# Altium schematic sheet Connectors.SchDoc
size A3; DocumentNumber: 11; SheetNumber: 11; SheetTotal: 11
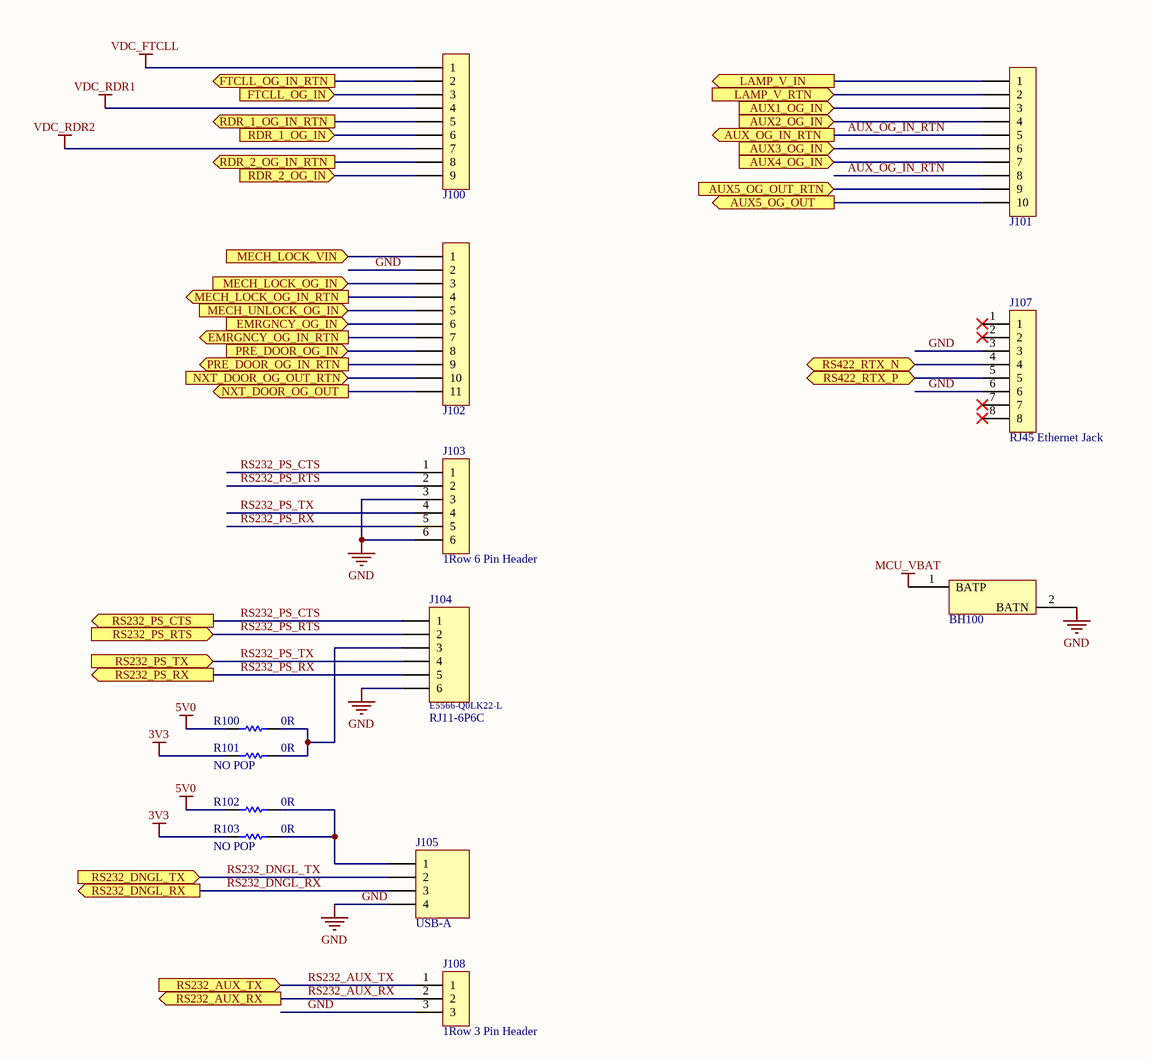
[diagram p0: Connectors.SchDoc]

## Parts
BH100  Battery Holder  [AE17-020T-2032-0101]  (value not drawn)
J100  (no value)  [AJ61-1009-TAPR-RNS0]
J101  (no value)  [AJ61-1010-TAPR-RNS0]
J102  (no value)  [AJ61-1011-TAPR-RNS0]
J103  1Row 6 Pin Header  [AJ23-1006-T8P0-VFC0]
J104  Manufacturer Part Number: E5566-Q0LK22-L  [AJ31-1006-TKSR-RPU0]  (hidden comment: RJ11-6P6C)
J105  USB-A  [AJA1-1004-TJSR-RAM0]
J107  RJ45 Ethernet Jack  [AJ32-1008-SD70-RTE0]
J108  1Row 3 Pin Header  [AJ23-1003-T8P0-VFC0]
R100  0R  [RESC1005X04N]
R101  Assembly: NO POP  [RESC1005X04N]  (hidden comment: 0R)
R102  0R  [RESC1005X04N]
R103  Assembly: NO POP  [RESC1005X04N]  (hidden comment: 0R)

## Ports
AUX1_OG_IN (in), AUX2_OG_IN (in), AUX3_OG_IN (in), AUX4_OG_IN (in), AUX5_OG_OUT (out), AUX5_OG_OUT_RTN (in), AUX_OG_IN_RTN (out), EMRGNCY_OG_IN (in), EMRGNCY_OG_IN_RTN (out), FTCLL_OG_IN (in), FTCLL_OG_IN_RTN (out), LAMP_V_IN (out), LAMP_V_RTN (in), MECH_LOCK_OG_IN (in), MECH_LOCK_OG_IN_RTN (out), MECH_LOCK_VIN (in), MECH_UNLOCK_OG_IN (in), NXT_DOOR_OG_OUT (out), NXT_DOOR_OG_OUT_RTN (in), PRE_DOOR_OG_IN (in), PRE_DOOR_OG_IN_RTN (out), RDR_1_OG_IN (in), RDR_1_OG_IN_RTN (out), RDR_2_OG_IN (in), RDR_2_OG_IN_RTN (out), RS232_AUX_RX (out), RS232_AUX_TX (in), RS232_DNGL_RX (out), RS232_DNGL_TX (in), RS232_PS_CTS (out), RS232_PS_RTS (in), RS232_PS_RX (out), RS232_PS_TX (in), RS422_RTX_N (bidir), RS422_RTX_P (bidir)

## Nets
3V3: R101.1 R103.1
5V0: R100.1 R102.1
GND: BH100.2(BATN) J102.2 J103.3 J103.6 J104.6 J105.4 J107.3 J107.6 J108.3
MCU_VBAT: BH100.1(BATP)
VDC_FTCLL: J100.1
VDC_RDR1: J100.4
VDC_RDR2: J100.7
AUX1_OG_IN: J101.3 ; port AUX1_OG_IN
AUX2_OG_IN: J101.4 ; port AUX2_OG_IN
AUX3_OG_IN: J101.6 ; port AUX3_OG_IN
AUX4_OG_IN: J101.7 ; port AUX4_OG_IN
AUX5_OG_OUT: J101.10 ; port AUX5_OG_OUT
AUX5_OG_OUT_RTN: J101.9 ; port AUX5_OG_OUT_RTN
AUX_OG_IN_RTN: J101.5 J101.8 ; port AUX_OG_IN_RTN
EMRGNCY_OG_IN: J102.6 ; port EMRGNCY_OG_IN
EMRGNCY_OG_IN_RTN: J102.7 ; port EMRGNCY_OG_IN_RTN
FTCLL_OG_IN: J100.3 ; port FTCLL_OG_IN
FTCLL_OG_IN_RTN: J100.2 ; port FTCLL_OG_IN_RTN
LAMP_V_IN: J101.1 ; port LAMP_V_IN
LAMP_V_RTN: J101.2 ; port LAMP_V_RTN
MECH_LOCK_OG_IN: J102.3 ; port MECH_LOCK_OG_IN
MECH_LOCK_OG_IN_RTN: J102.4 ; port MECH_LOCK_OG_IN_RTN
MECH_LOCK_VIN: J102.1 ; port MECH_LOCK_VIN
MECH_UNLOCK_OG_IN: J102.5 ; port MECH_UNLOCK_OG_IN
NXT_DOOR_OG_OUT: J102.11 ; port NXT_DOOR_OG_OUT
NXT_DOOR_OG_OUT_RTN: J102.10 ; port NXT_DOOR_OG_OUT_RTN
PRE_DOOR_OG_IN: J102.8 ; port PRE_DOOR_OG_IN
PRE_DOOR_OG_IN_RTN: J102.9 ; port PRE_DOOR_OG_IN_RTN
RDR_1_OG_IN: J100.6 ; port RDR_1_OG_IN
RDR_1_OG_IN_RTN: J100.5 ; port RDR_1_OG_IN_RTN
RDR_2_OG_IN: J100.9 ; port RDR_2_OG_IN
RDR_2_OG_IN_RTN: J100.8 ; port RDR_2_OG_IN_RTN
RS232_AUX_RX: J108.2 ; port RS232_AUX_RX
RS232_AUX_TX: J108.1 ; port RS232_AUX_TX
RS232_DNGL_RX: J105.3 ; port RS232_DNGL_RX
RS232_DNGL_TX: J105.2 ; port RS232_DNGL_TX
RS232_PS_CTS: J103.1 J104.1 ; port RS232_PS_CTS
RS232_PS_RTS: J103.2 J104.2 ; port RS232_PS_RTS
RS232_PS_RX: J103.5 J104.5 ; port RS232_PS_RX
RS232_PS_TX: J103.4 J104.4 ; port RS232_PS_TX
RS422_RTX_N: J107.4 ; port RS422_RTX_N
RS422_RTX_P: J107.5 ; port RS422_RTX_P
NetJ104_3: J104.3 R100.2 R101.2
NetJ105_1: J105.1 R102.2 R103.2

Not connected (* = marked no-connect by the designer): J107 1* 2* 7* 8*

## Notes on the sheet
- Title
- Size:
- Date:
- A3
- Number:
- Time:
- Revision:
- Sheet
- of
- File:

## Library data of the parts
BH100 = AE17-020T-2032-0101: Battery Holder, 1xCoin 20, 2032, TH, V; Manufacturer: MPD; Manufacturer Part Number: BC2032-E2; Published By: IS; Requested By: NK; CR: -; DS: -; Definition Date: 20.08.2015; Height: 5.08; Operating Temp: -40 °C to +180 °C; Footprint Type: TH; Revision: *; Revision Date: *; Lead Finish: *; Status: Active; Storage Temp: -40 °C to +180 °C; Component Type: Battery Holder; JEDEC Code: *; Package Reference: *; Price: *; Supplier: *; Supplier Part Number: *; Current Rating: -; Max. Operating Voltage: -; Value: Battery Holder
J100 = AJ61-1009-TAPR-RNS0: CON, Terminal, Klemens, 9 Pins, 1-Row, 5.08mm, TH, P, R; Manufacturer: ON-SHORE; Manufacturer Part Number: OSTOQ095451; Requested by: NK; Lead Finish: Pb Free; Max. Operating Voltage: 250VAC; Rated Current: 15A; CR: -; Definition Date: 11.08.2015; Revision Date: *; Price: *; Supplier: *; Supplier Part Number: *; DS: -; Operating Temp: -30, +105; Storage Temp: -30, +105; Status: Active; Package Reference: *; Component Type: Connector; Footprint Type: TH; Published by: NK; JEDEC Code: *; Material: *
J101 = AJ61-1010-TAPR-RNS0: CON, Terminal, Klemens, 10 Pins, 1-Row, 5.08mm, TH, P, R; Manufacturer: ON-SHORE; Manufacturer Part Number: OSTOQ105451; Requested by: NK; Lead Finish: Pb Free; Max. Operating Voltage: 250VAC; Rated Current: 15A; CR: -; Definition Date: 11.08.2015; Revision Date: *; Price: *; Supplier: *; Supplier Part Number: *; DS: -; Operating Temp: -30, +105; Storage Temp: -30, +105; Status: Active; Package Reference: *; Component Type: Connector; Footprint Type: TH; Published by: NK; JEDEC Code: *; Material: *
J102 = AJ61-1011-TAPR-RNS0: CON, Terminal, Klemens, 11 Pins, 1-Row, 5.08mm, TH, P, R; Manufacturer: ON-SHORE; Manufacturer Part Number: OSTOQ115451; Requested by: NK; Lead Finish: Pb Free; Max. Operating Voltage: 250VAC; Rated Current: 15A; CR: -; Definition Date: 11.08.2015; Revision Date: *; Price: *; Supplier: *; Supplier Part Number: *; DS: -; Operating Temp: -30, +105; Storage Temp: -30, +105; Status: Active; Package Reference: *; Component Type: Connector; Footprint Type: TH; Published by: NK; JEDEC Code: *; Material: *
J103 = AJ23-1006-T8P0-VFC0: CON, W2B, 6 Pins, 1-Row, 2.54mm, TH, P, VER; Manufacturer: FCI; Manufacturer Part Number: 68001-206HLF; CR: 000184; Requested by: NK; Lead Finish: Pb Free; Published by: MU; Definition Date: 30.01.2013; Revision Date: *; Price: *; Supplier: *; Supplier Part Number: *; DS: 000184; Operating Temp: *; Storage Temp: *; Status: Active; Package Reference: *; Component Type: Connector; Footprint Type: TH; JEDEC Code: *; Material: *; Max. Operating Voltage: *; Rated Current: *; Value: 1Row 6 Pin Header
J104 = AJ31-1006-TKSR-RPU0: CON, Jack, 6P6C, 1 Row, 6 Pins, 1.02 mm, TH, S, RA; Manufacturer: Pulse; Requested by: NK; Lead Finish: Pb Free; Max. Operating Voltage: 125V; Rated Current: 1.5A; CR: -; Definition Date: 11.08.2015; Revision Date: *; Price: *; Supplier: *; Supplier Part Number: *; DS: -; Operating Temp: -40°C to +85°C; Storage Temp: -40°C to +105°C; Status: Active; Package Reference: *; Component Type: Connector; Footprint Type: SMD; Published by: NK; JEDEC Code: *; Material: *; Value: RJ11-6P6C
J105 = AJA1-1004-TJSR-RAM0: CON, USB, 4 pins, RA, TH; Manufacturer: Amphenol Commercial; Manufacturer Part Number: UE27AC54100; Requested by: NK; Lead Finish: Pb Free; CR: *; Definition Date: 08.08.2015; Revision Date: *; Price: *; Supplier: *; Supplier Part Number: *; DS: *; Operating Temp: -55 to 155 C; Storage Temp: -55 to 155 C; Status: Active; Package Reference: -; Component Type: Connector; Footprint Type: TH; Published by: NK; JEDEC Code: *; Material: *; Max. Operating Voltage: -; Value: USB-A
J107 = AJ32-1008-SD70-RTE0: CON, Jack, 8 Pins, 1-Row, 0.61mm, SMD, S, RA; Manufacturer: TE Connectivity; Manufacturer Part Number: 5406721-2; CR: 000175; Requested by: OO; Lead Finish: Pb Free; Published by: MU; Max. Operating Voltage: 150V; Rated Current: 1.5A @25 C; Definition Date: 17.12.2012; Revision Date: *; Price: *; Supplier: *; Supplier Part Number: *; DS: 000175; Operating Temp: *; Storage Temp: *; Status: Active; Package Reference: *; Component Type: Connector; Footprint Type: SMD; JEDEC Code: *; Material: *; Value: RJ45 Ethernet Jack
J108 = AJ23-1003-T8P0-VFC0: CON, W2B, 3 Pins, 1-Row, 2.54mm, TH, P, VER; Manufacturer: FCI; Manufacturer Part Number: 68001-203HLF; CR: 000184; Requested by: NK; Lead Finish: Pb Free; Published by: MU; Definition Date: 30.01.2013; Revision Date: *; Price: *; Supplier: *; Supplier Part Number: *; DS: 000184; Operating Temp: *; Storage Temp: *; Status: Active; Package Reference: *; Component Type: Connector; Footprint Type: TH; JEDEC Code: *; Material: *; Max. Operating Voltage: *; Rated Current: *; Value: 1Row 3 Pin Header
R100-R103 = AR19-0000-S201-0000: RES, Thick Film, SMD, 0R, Jumper, 0.1W, 0402; Manufacturer: Panasonic; Manufacturer Part Number: ERJ-2GE0R00X; CR: 000062; Requested by: MAY; Lead Finish: Pb Free; Published by: MU; Max. Operating Voltage: 50V; Definition Date: 09.07.2012; Revision Date: *; Price: *; Supplier: *; Supplier Part Number: *; DS: 000062; Operating Temp: -55 to 155 C; Storage Temp: -55 to 155 C; Status: Active; Package Reference: EIA 0402, Metric 1005; Component Type: Resistor; Footprint Type: SMD; JEDEC Code: *; Material: Thick Film; ESR: *; FR: *; Power Rating: 0.1W; Value: 0R